# EAGLE design daughter (EAGLE 6.4)
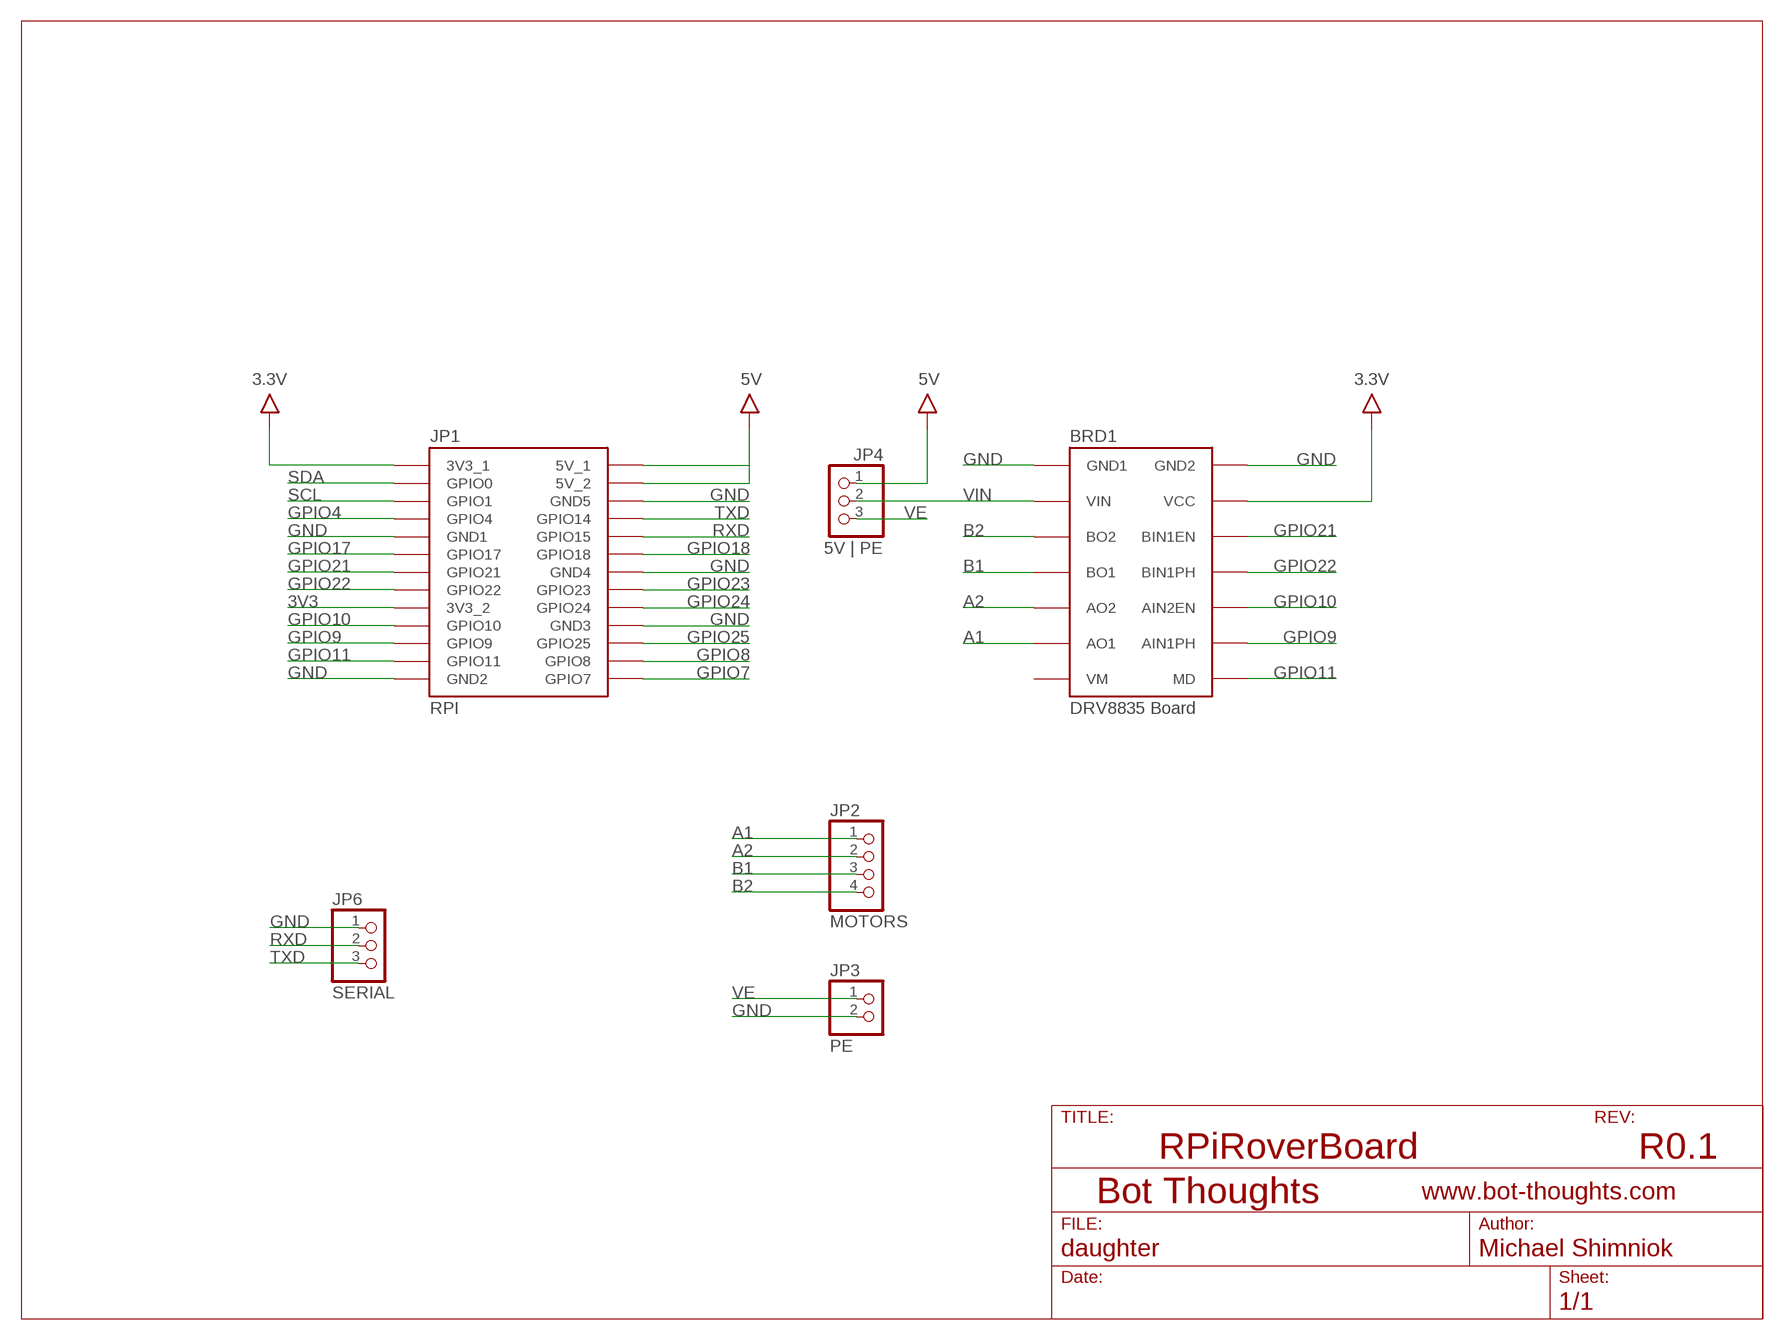
[diagram p0: schematic, sheet 1]

## Parts
BRD1  DRV8835 Board  DRV8835BRD  [DRV8835BRD]
JP1  RPI  [RPI]
JP2  MOTORS  PINHD-1X04_2.54-S  [1X04-S]
JP3  PE  PINHD-1X02_2.54-S  [1X02-S]
JP4  5V | PE  PINHD-1X03_2.54-S  [1X03-S]
JP6  SERIAL  PINHD-1X03_2.54-S  [1X03-S]

## Nets
3.3V: BRD1.VCC JP1.3V3_1
3V3: JP1.3V3_2
5V: JP1.5V_1 JP1.5V_2 JP4.1
A1: BRD1.AO1 JP2.1
A2: BRD1.AO2 JP2.2
B1: BRD1.BO1 JP2.3
B2: BRD1.BO2 JP2.4
GND: BRD1.GND1 BRD1.GND2 JP1.GND1 JP1.GND2 JP1.GND3 JP1.GND4 JP1.GND5 JP3.2 JP6.1
GPIO4: JP1.GPIO4
GPIO7: JP1.GPIO7
GPIO8: JP1.GPIO8
GPIO9: BRD1.AIN1PH JP1.GPIO9
GPIO10: BRD1.AIN2EN JP1.GPIO10
GPIO11: BRD1.MD JP1.GPIO11
GPIO17: JP1.GPIO17
GPIO18: JP1.GPIO18
GPIO21: BRD1.BIN2EN(BIN1EN) JP1.GPIO21
GPIO22: BRD1.BIN1PH JP1.GPIO22
GPIO23: JP1.GPIO23
GPIO24: JP1.GPIO24
GPIO25: JP1.GPIO25
RXD: JP1.GPIO15 JP6.2
SCL: JP1.GPIO1
SDA: JP1.GPIO0
TXD: JP1.GPIO14 JP6.3
VE: JP3.1 JP4.3
VIN: BRD1.VIN JP4.2
Unconnected: BRD1.VM

## Notes on the sheet
- RPiRoverBoard | R0.1

## Library data of the parts
BRD1 = bt:DRV8835: Ti DRV8835 Motor Driver
JP1 = bt:RPI: Raspberry Pi connector
JP2 = pinhead-2:PINHD-1X04: PIN HEADER
JP3 = pinhead-2:PINHD-1X02: PIN HEADER
JP4 JP6 = pinhead-2:PINHD-1X03: PIN HEADER

## Board
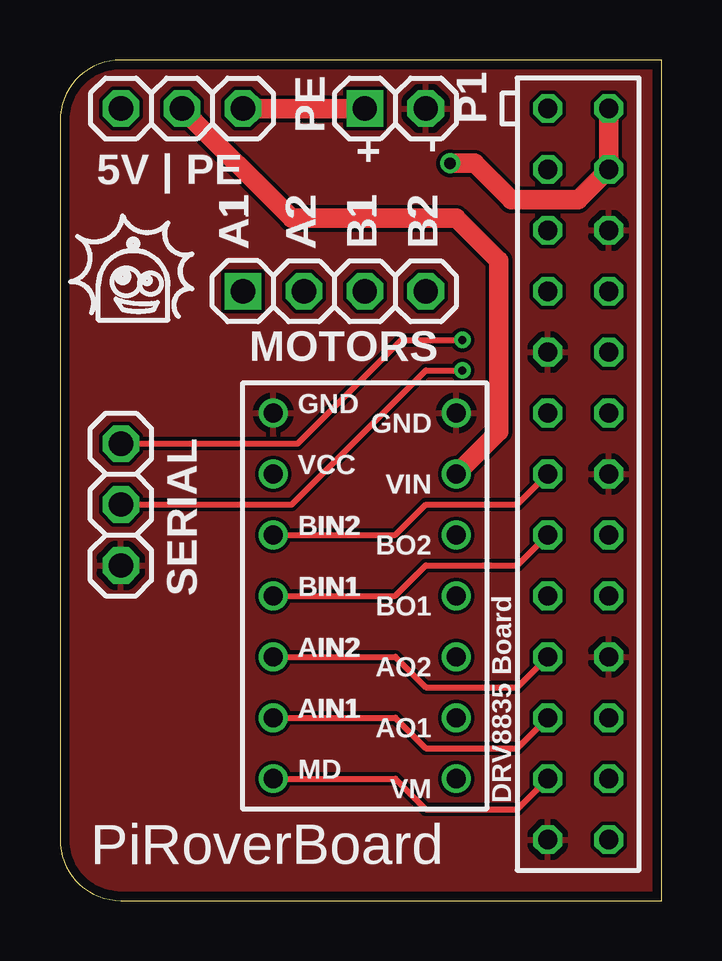
[diagram p1: board, top side]
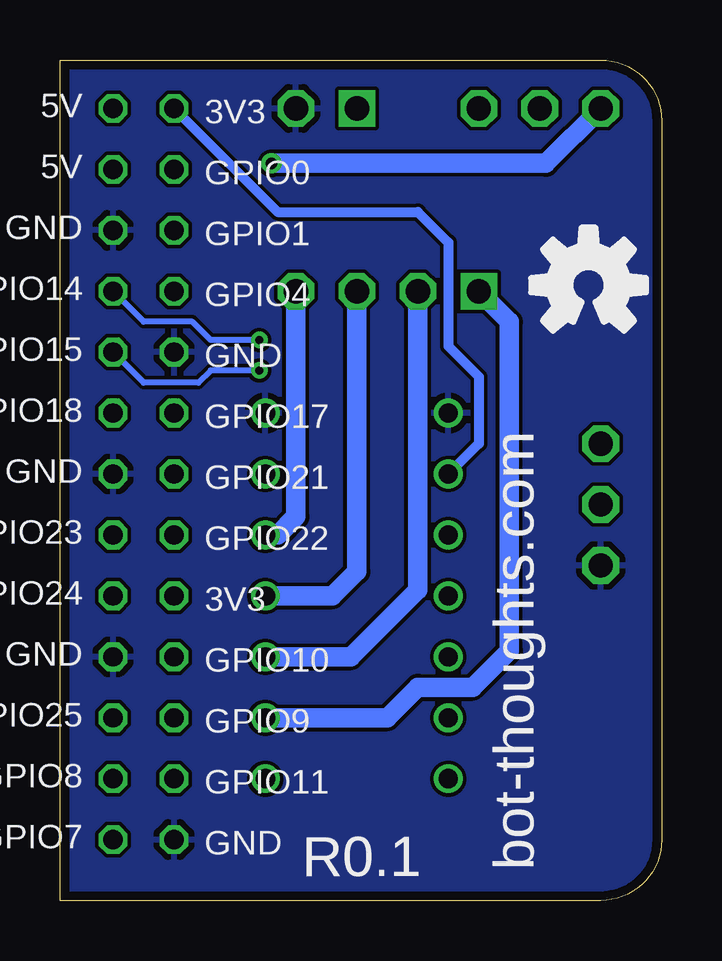
[diagram p2: board, bottom side, seen from below]

Size 25.07 x 35.04 mm. Coordinates in mm from the lower left corner, seen from the top.
Outline: 25.07,35.04 2.54,35.04 arc90 0,32.5 0,2.54 arc90 2.54,0 25.07,0 25.07,35.04
Copper layers (1*16): Top 0.0356mm / dielectric 1.5011mm / Bottom 0.0356mm
Design rules "LaenPCBOrder *": minimum track width 6mil, minimum drill 13mil, track to track 6mil, track to pad 6mil, pad to pad 6mil, via to via 6mil, smd to smd 6mil, copper to edge 15mil, drill to drill 6mil, minimum pad ring 7mil, minimum via ring 7mil, stop-mask expansion 4mil, vias tented up to drill 19mil, thermal gap 10mil

### Footprints (pad centres in the part's own frame; a part is rotated, then mirrored left to right if it is on the bottom)
DRV8835BRD = drill 0.8: AIN1PH -3.81,-5.08; AIN2EN -3.81,-2.54; AO1 3.81,-5.08; AO2 3.81,-2.54; BIN1PH -3.81,0; BIN2EN -3.81,2.54; BO1 3.81,0; BO2 3.81,2.54; GND1 -3.81,7.62; GND2 3.81,7.62; MD -3.81,-7.62; VCC -3.81,5.08; VIN 3.81,5.08; VM 3.81,-7.62
RPI = drill 0.8 octagon: 3V3_1 -1.27,1.27; 3V3_2 -1.27,-19.05; 5V_1 1.27,-1.27; 5V_2 1.27,1.27; GND1 -1.27,-8.89; GND2 -1.27,-29.21; GND3 1.27,-21.59; GND4 1.27,-13.97; GND5 1.27,-3.81; GPIO0 -1.27,-1.27; GPIO1 -1.27,-3.81; GPIO4 -1.27,-6.35; GPIO7 1.27,-29.21; GPIO8 1.27,-26.67; GPIO9 -1.27,-24.13; GPIO10 -1.27,-21.59; GPIO11 -1.27,-26.67; GPIO14 1.27,-6.35; GPIO15 1.27,-8.89; GPIO17 -1.27,-11.43; GPIO18 1.27,-11.43; GPIO21 -1.27,-13.97; GPIO22 -1.27,-16.51; GPIO23 1.27,-16.51; GPIO24 1.27,-19.05; GPIO25 1.27,-24.13
1X04-S = drill 1.016 square: 1 -3.81,0 | drill 1.016 octagon: 2 -1.27,0; 3 1.27,0; 4 3.81,0
1X02-S = drill 1.016 square: 1 -1.27,0 | drill 1.016 octagon: 2 1.27,0
1X03-S = drill 1.016 octagon: 1 -2.54,0; 2 0,0; 3 2.54,0

### Placement (x,y rotation side)
BRD1  12.7,12.7 0 top
JP1  21.59,31.75 0 top
JP2  11.43,25.4 0 top
JP3  13.97,33.02 0 top
JP4  5.08,33.02 0 top
JP6  2.54,16.51 90 top

### Tracks (layer width: path | path; a pad name or v marks a point on that pad's centre or on a via)
3.3V
  Bottom 0.406: JP1.3V3_1 16,28.7 10.16,28.7 8.89,27.43 8.89,23.11 7.62,21.84 7.62,19.05 BRD1.VCC
5V  (via drill 0.48)
  Top 0.813: v16.26,30.73 17.27,30.73 18.8,29.21 21.59,29.21 JP1.5V_1 JP1.5V_2
  Bottom 0.813: JP4.1 4.83,30.73 v16.26,30.73
A1
  Bottom 0.813: BRD1.AO1 11.43,7.62 10.16,8.89 7.87,8.89 6.35,10.41 6.35,24.13 JP2.1
A2
  Bottom 0.813: BRD1.AO2 12.95,10.16 10.16,12.95 JP2.2
B1
  Bottom 0.813: BRD1.BO1 13.72,12.7 12.7,13.72 JP2.3
B2
  Bottom 0.813: BRD1.BO2 16,15.24 15.24,16 JP2.4
GND
  pour Top: 0,2.54 0,32.51 arc-90 2.54,35.05 25.15,35.05 25.15,0 2.54,0 arc-90
  pour Bottom: 0,2.54 0,32.26 arc-90 2.54,34.8 24.89,34.8 24.89,0 2.54,0 arc-90
GPIO9
  Top 0.254: BRD1.AIN1PH 13.97,7.62 15.24,6.35 19.05,6.35 JP1.GPIO9
GPIO10
  Top 0.254: BRD1.AIN2EN 13.97,10.16 15.24,8.89 19.05,8.89 JP1.GPIO10
GPIO11
  Top 0.254: BRD1.MD 13.97,5.08 15.24,3.81 19.05,3.81 JP1.GPIO11
GPIO21
  Top 0.254: BRD1.BIN2EN 13.97,15.24 15.24,16.51 19.05,16.51 JP1.GPIO21
GPIO22
  Top 0.254: BRD1.BIN1PH 13.97,12.7 15.24,13.97 19.05,13.97 JP1.GPIO22
RXD  (via drill 0.33)
  Top 0.254: JP6.2 9.65,16.51 15.24,22.1 v16.76,22.1
  Bottom 0.254: v16.76,22.1 18.8,22.1 19.3,21.59 21.59,21.59 JP1.GPIO15
TXD  (via drill 0.33)
  Top 0.254: JP6.3 9.91,19.05 14.22,23.37 v16.76,23.37
  Bottom 0.254: v16.76,23.37 18.8,23.37 19.56,24.13 21.59,24.13 JP1.GPIO14
VE
  Top 0.813: JP4.3 JP3.1
VIN
  Top 0.813: JP4.2 9.65,28.45 16.51,28.45 18.29,26.67 18.29,19.56 BRD1.VIN

### Text on the board
tPlace: A1 | A2 | B1 | B2
tNames: + | - | PiRoverBoard
bNames: bot-thoughts.com | R0.1
tsilk: PE | + | - | P1 | 5V | PE | A1 | A2 | B1 | B2 | MOTORS | GND | GND | VCC | VIN | BIN2 | BO2 | SERIAL | BIN1 | BO1 | AIN2 | AO2 | AIN1 | AO1 | MD | VM | DRV8835 Board | PiRoverBoard
bsilk: bot-thoughts.com | R0.1